# EasyEDA schematic SCH_Pool2022-Hardware_2022-02-03.json
TITLE: Sheet_1; REV: 1.0; Date: 2021-11-21; Sheet: 1/1; Drawn By: The Zap; Company: Your Company
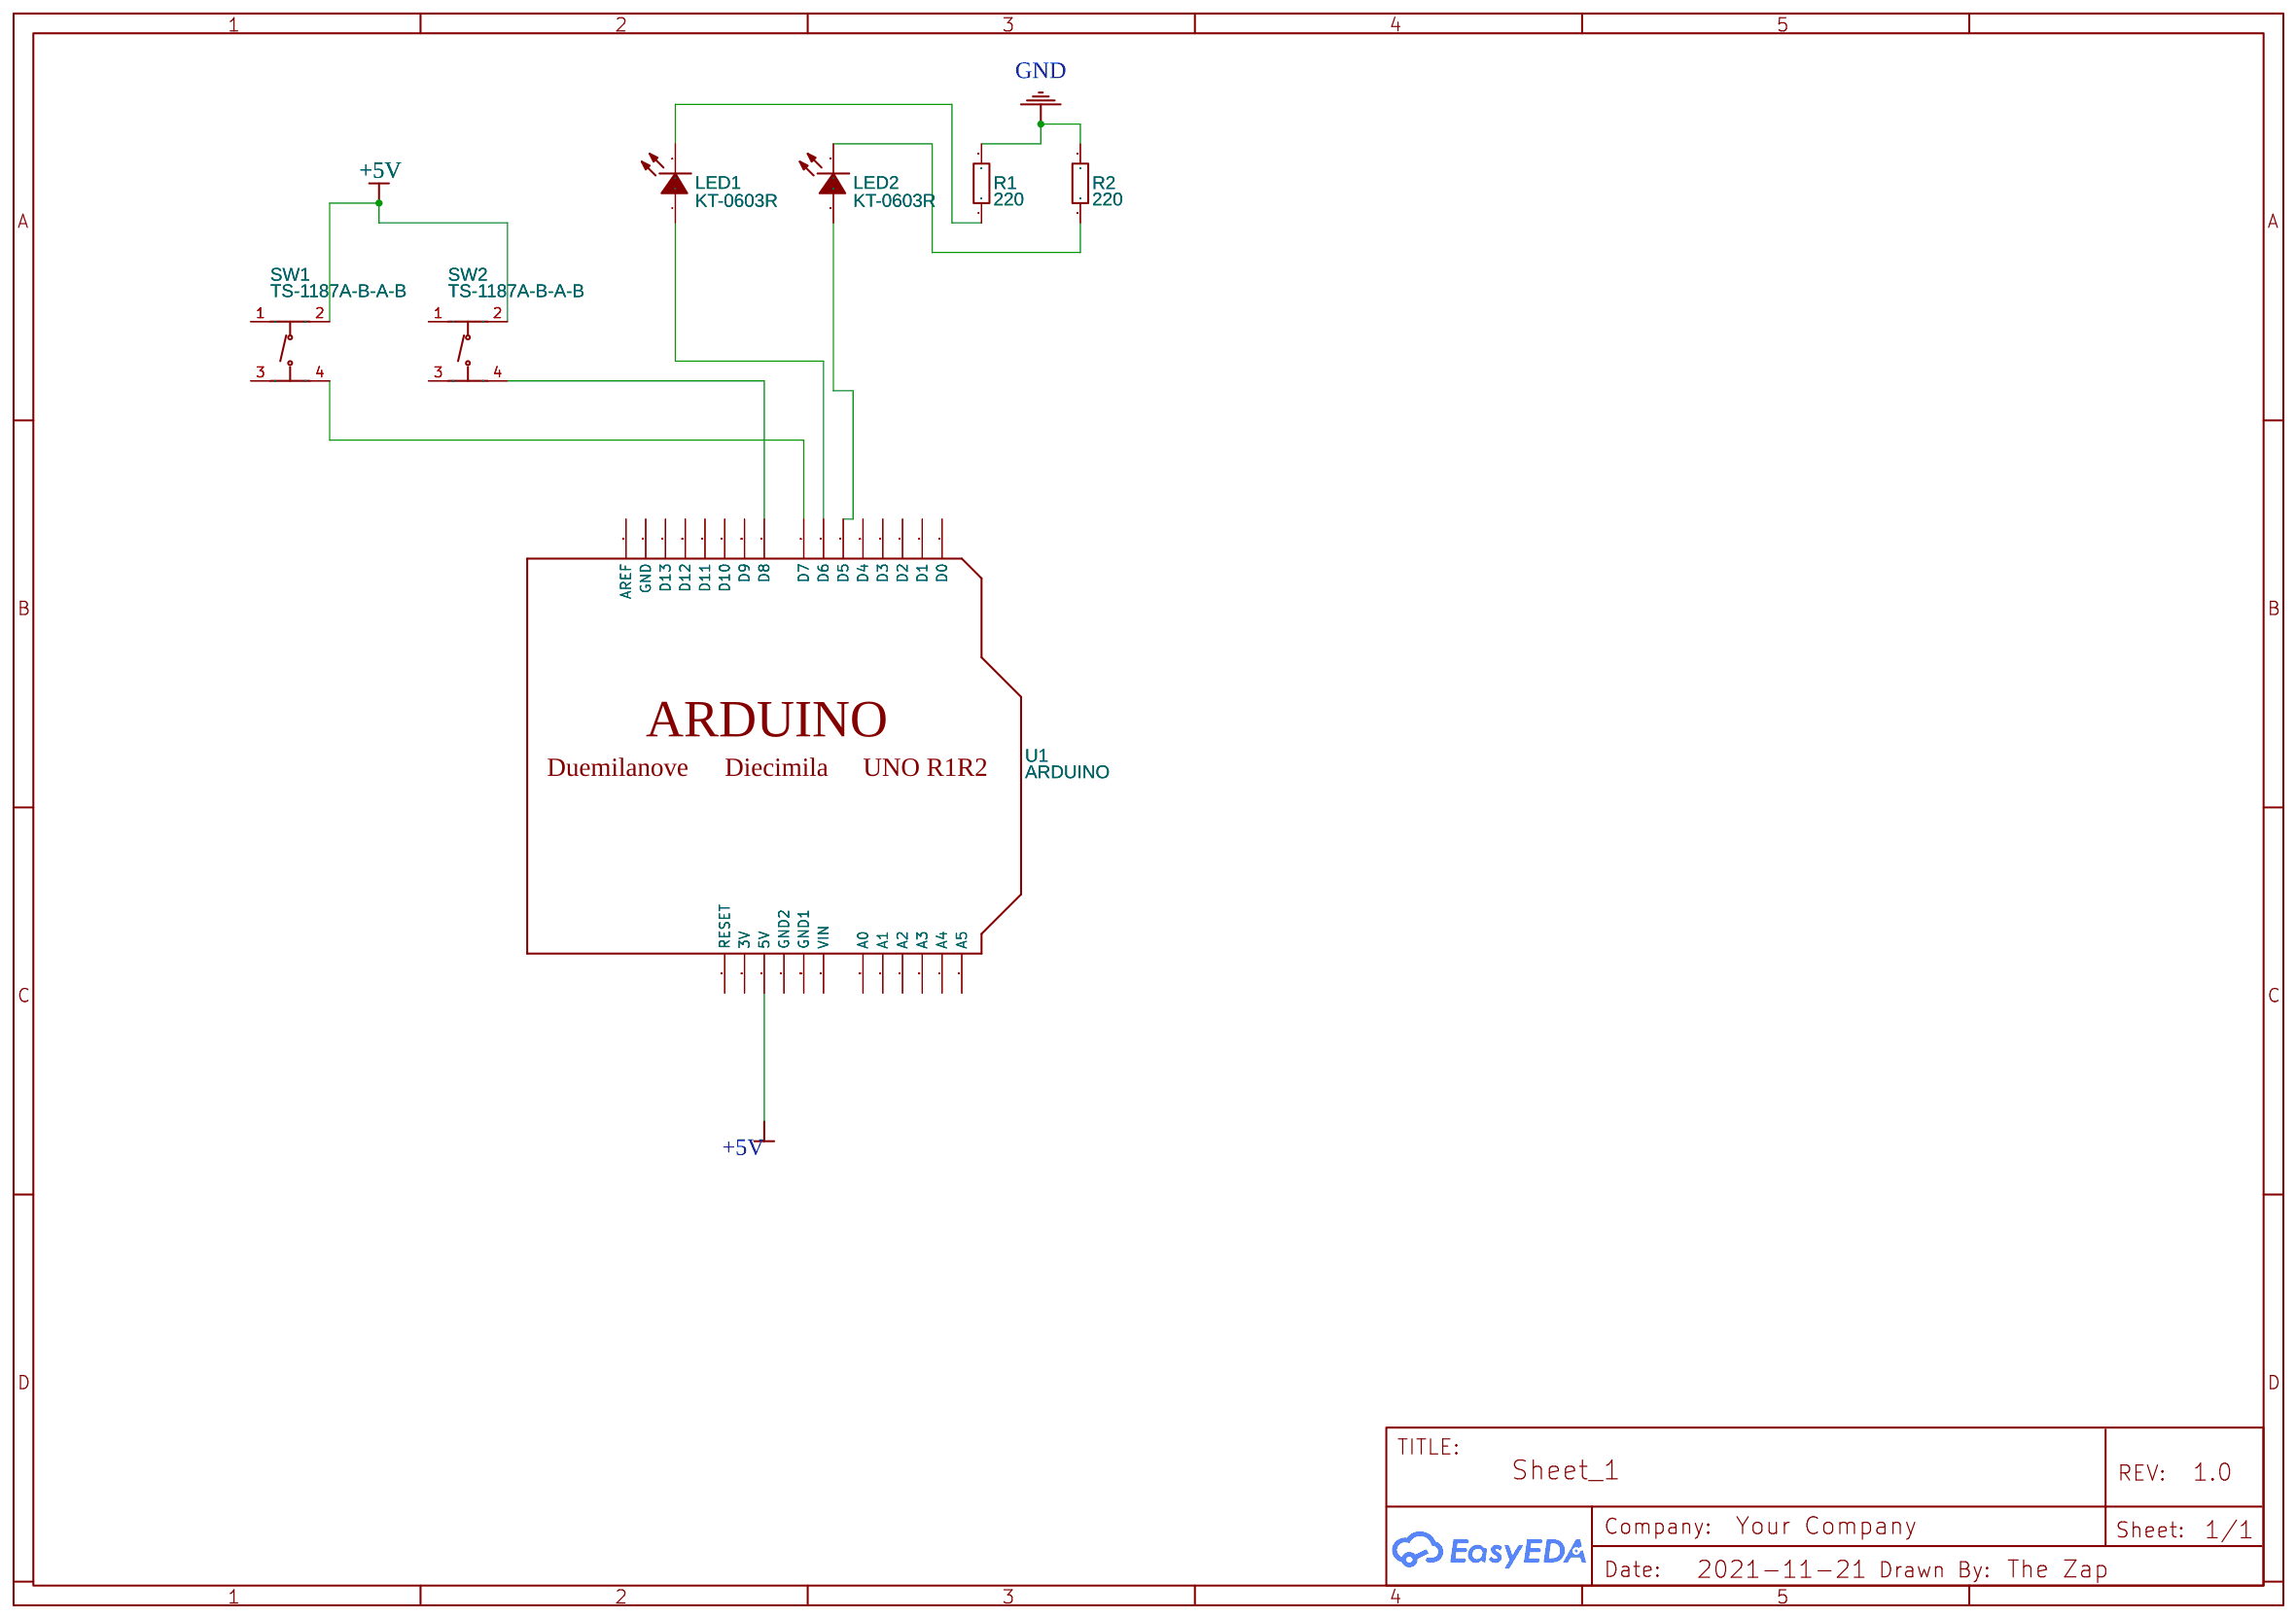
[diagram p0: schematic sheet]

## Parts
LED1  KT-0603R  [LED0603-R-RD]
LED2  KT-0603R  [LED0603-R-RD]
R1  220  [R0805]
R2  220  [R0805]
SW1  TS-1187A-B-A-B  [SW-SMD_4P-L5.1-W5.1-P3.70-LS6.5-TL-2]
SW2  TS-1187A-B-A-B  [SW-SMD_4P-L5.1-W5.1-P3.70-LS6.5-TL-2]
U1  ARDUINO  [ARDUINO-BPLACE]

## Library data of the parts
LED1 LED2 = KT-0603R: Supplier: LCSC; Manufacturer: KENTO; Supplier Part: C2286; JLCPCB Part Class: Basic Part
R1 R2 = 0805W8F2200T5E: Supplier: LCSC; Manufacturer: UniOhm; Supplier Part: C17557; JLCPCB Part Class: Basic Part
SW1 SW2 = TS-1187A-B-A-B: Supplier: LCSC; Supplier Part: C318884; Manufacturer: XKB Enterprise; Contributor: LCSC; JLCPCB Part Class: Extended Part
U1 = ARDUINO: Contributor: Adafruit

## Nets
+5V: SW1.2(B) SW2.2(B) U1.5V
GND: R1.2 R2.2
Net-(LED1-1): LED1.1(A) U1.D6
Net-(LED1-2): LED1.2(K) R1.1
Net-(LED2-1): LED2.1(A) U1.D5
Net-(LED2-2): LED2.2(K) R2.1
Net-(SW1-4): SW1.4(D) U1.D7
Net-(SW2-4): SW2.4(D) U1.D8

Not connected (* = marked no-connect by the designer): SW1 1(A) 3(C); SW2 1(A) 3(C); U1 3V A0 A1 A2 A3 A4 A5 AREF D0 D1 D2 D3 D4 D9 D10 D11 D12 D13 GND GND1 GND2 RESET VIN
